# Altium project fpga_board.PrjPcb (part 2 of 2)

## Sheet FPGA2.SchDoc
size A4; SheetNumber: 8; SheetTotal: 9
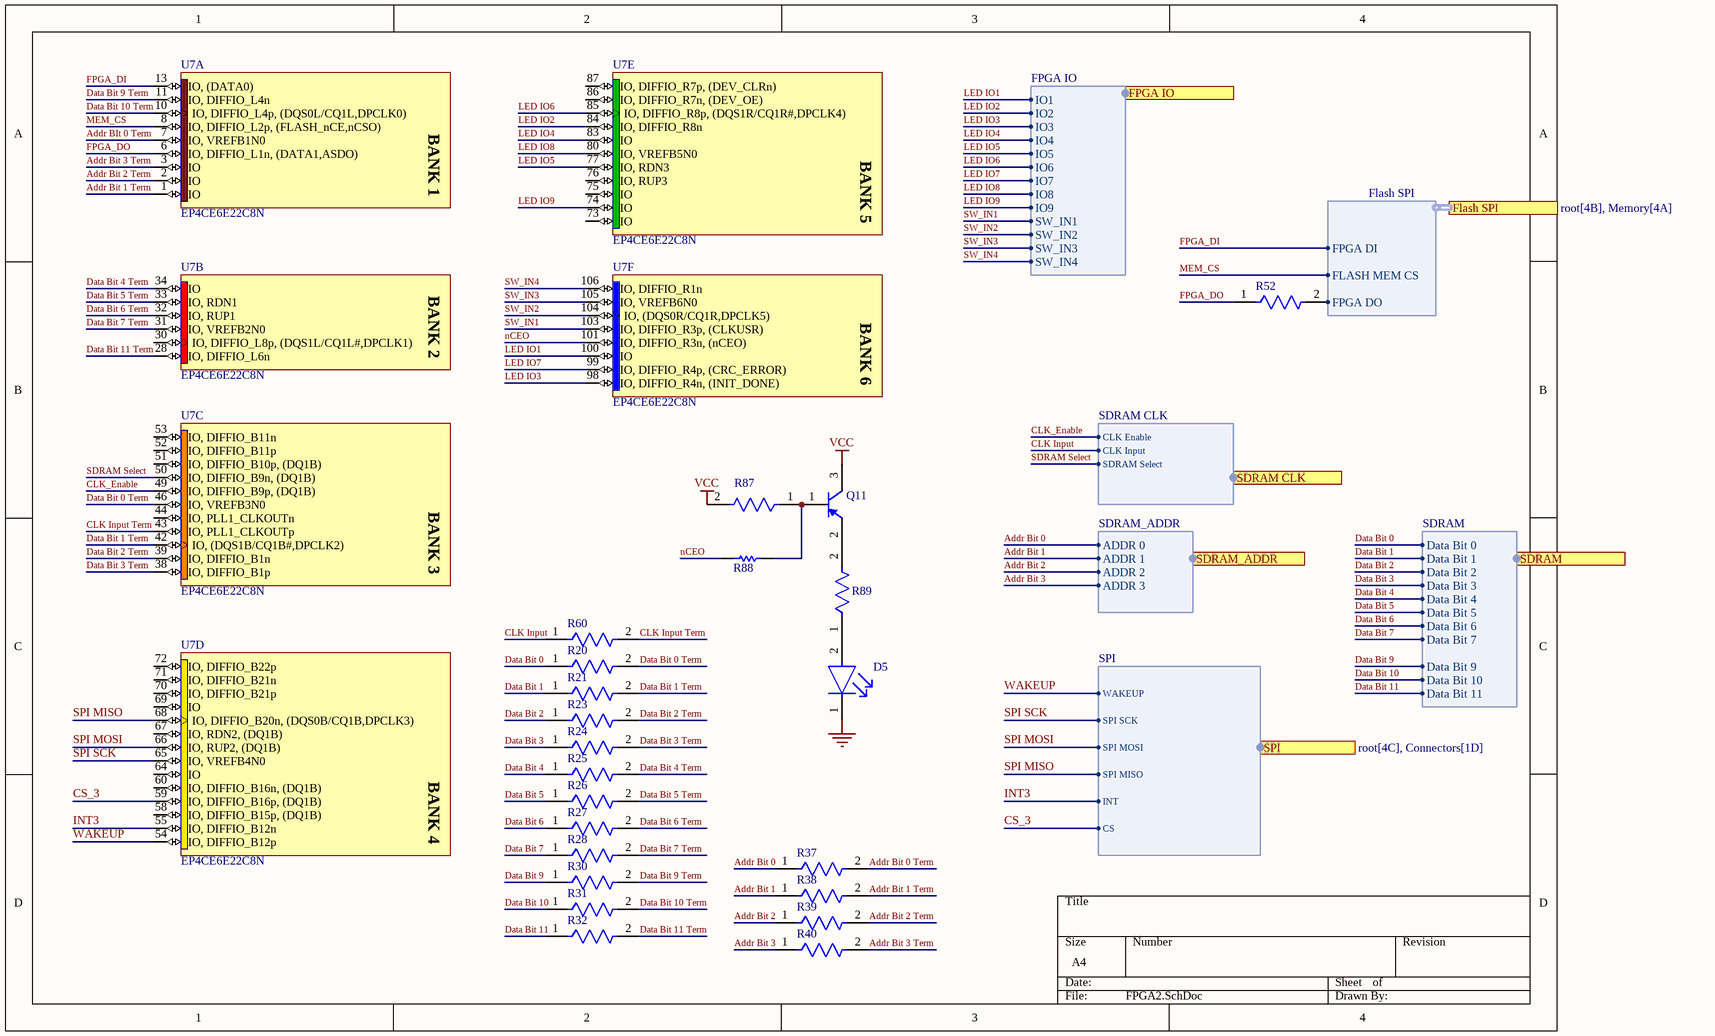
[diagram p6: FPGA2.SchDoc]

### Parts
D5  APHCM2012CGCK-F01  [FP-APHCM2012CGCK-F01-MFG]  (value not drawn)
Q11  MMBT3906LT1G  [ONSC-SOT-23-3-318-08_V]  (value not drawn)
R20  RT0402BRE0750RL  [FP-RT0402-0_35-MFG]  (value not drawn)
R21  RT0402BRE0750RL  [FP-RT0402-0_35-MFG]  (value not drawn)
R23  RT0402BRE0750RL  [FP-RT0402-0_35-MFG]  (value not drawn)
R24  RT0402BRE0750RL  [FP-RT0402-0_35-MFG]  (value not drawn)
R25  RT0402BRE0750RL  [FP-RT0402-0_35-MFG]  (value not drawn)
R26  RT0402BRE0750RL  [FP-RT0402-0_35-MFG]  (value not drawn)
R27  RT0402BRE0750RL  [FP-RT0402-0_35-MFG]  (value not drawn)
R28  RT0402BRE0750RL  [FP-RT0402-0_35-MFG]  (value not drawn)
R30  RT0402BRE0750RL  [FP-RT0402-0_35-MFG]  (value not drawn)
R31  RT0402BRE0750RL  [FP-RT0402-0_35-MFG]  (value not drawn)
R32  RT0402BRE0750RL  [FP-RT0402-0_35-MFG]  (value not drawn)
R37  RT0402BRE0750RL  [FP-RT0402-0_35-MFG]  (value not drawn)
R38  RT0402BRE0750RL  [FP-RT0402-0_35-MFG]  (value not drawn)
R39  RT0402BRE0750RL  [FP-RT0402-0_35-MFG]  (value not drawn)
R40  RT0402BRE0750RL  [FP-RT0402-0_35-MFG]  (value not drawn)
R52  RT0402BRE0750RL  [FP-RT0402-0_35-MFG]  (value not drawn)
R60  RT0402BRE0750RL  [FP-RT0402-0_35-MFG]  (value not drawn)
R87  RC0603FR-0710KL  [FP-RC0603-0_55-IPC_C]  (value not drawn)
R88  RC0402FR-07330RL  [RESC1005X40X25LL05T10]  (value not drawn)
R89  RC0603FR-0710KL  [FP-RC0603-0_55-IPC_C]  (value not drawn)
U7  EP4CE6E22C8N  [EQFP144_A-165_D2-54_M]  (parts A,B,C,D,E,F of 13)

### Ports
Flash SPI (harness Flash SPI, see root[4B], Memory[4A]), FPGA IO (harness FPGA IO, see root[4B], IOs[1A]), SDRAM (harness SDRAM, see root[4B], Memory[4B]), SDRAM CLK (harness SDRAM CLK, see root[4C], Memory[2D]), SDRAM_ADDR (harness SDRAM_ADDR, see root[4B], Memory[2C]), SPI (harness SPI, see root[4C], Connectors[1D])

### Harnesses
FPGA IO: IO1, IO2, IO3, IO4, IO5, IO6, IO7, IO8, IO9, SW_IN1, SW_IN2, SW_IN3, SW_IN4
Flash SPI: FPGA DI, FLASH MEM CS, FPGA DO
SDRAM: Data Bit 0, Data Bit 1, Data Bit 2, Data Bit 3, Data Bit 4, Data Bit 5, Data Bit 6, Data Bit 7, Data Bit 9, Data Bit 10, Data Bit 11
SDRAM_ADDR: ADDR 0, ADDR 1, ADDR 2, ADDR 3
SDRAM CLK: CLK Enable, CLK Input, SDRAM Select
SPI: WAKEUP, SPI SCK, SPI MOSI, SPI MISO, INT, CS

### Nets
GND: D5.1(C)
VCC: Q11.3(C) R87.2
Addr Bit 0: R37.1 ; port SDRAM_ADDR.ADDR 0
Addr BIt 0 Term: R37.2 U7.7(IO,_VREFB1N0)
Addr Bit 1: R38.1 ; port SDRAM_ADDR.ADDR 1
Addr Bit 1 Term: R38.2 U7.1(IO)
Addr Bit 2: R39.1 ; port SDRAM_ADDR.ADDR 2
Addr Bit 2 Term: R39.2 U7.2(IO)
Addr Bit 3: R40.1 ; port SDRAM_ADDR.ADDR 3
Addr Bit 3 Term: R40.2 U7.3(IO)
CLK Input: R60.1 ; port SDRAM CLK.CLK Input
CLK Input Term: R60.2 U7.43(IO,_PLL1_CLKOUTp)
CLK_Enable: U7.49(IO,_DIFFIO_B9p,_(DQ1B)) ; port SDRAM CLK.CLK Enable
CS_3: U7.59(IO,_DIFFIO_B16p,_(DQ1B)) ; port SPI.CS
Data Bit 0: R20.1 ; port SDRAM.Data Bit 0
Data Bit 0 Term: R20.2 U7.46(IO,_VREFB3N0)
Data Bit 1: R21.1 ; port SDRAM.Data Bit 1
Data Bit 1 Term: R21.2 U7.42(IO,_(DQS1B/CQ1B#,DPCLK2))
Data Bit 2: R23.1 ; port SDRAM.Data Bit 2
Data Bit 2 Term: R23.2 U7.39(IO,_DIFFIO_B1n)
Data Bit 3: R24.1 ; port SDRAM.Data Bit 3
Data Bit 3 Term: R24.2 U7.38(IO,_DIFFIO_B1p)
Data Bit 4: R25.1 ; port SDRAM.Data Bit 4
Data Bit 4 Term: R25.2 U7.34(IO)
Data Bit 5: R26.1 ; port SDRAM.Data Bit 5
Data Bit 5 Term: R26.2 U7.33(IO,_RDN1)
Data Bit 6: R27.1 ; port SDRAM.Data Bit 6
Data Bit 6 Term: R27.2 U7.32(IO,_RUP1)
Data Bit 7: R28.1 ; port SDRAM.Data Bit 7
Data Bit 7 Term: R28.2 U7.31(IO,_VREFB2N0)
Data Bit 9: R30.1 ; port SDRAM.Data Bit 9
Data Bit 9 Term: R30.2 U7.11(IO,_DIFFIO_L4n)
Data Bit 10: R31.1 ; port SDRAM.Data Bit 10
Data Bit 10 Term: R31.2 U7.10(IO,_DIFFIO_L4p,_(DQS0L/CQ1L,DPCLK0))
Data Bit 11: R32.1 ; port SDRAM.Data Bit 11
Data Bit 11 Term: R32.2 U7.28(IO,_DIFFIO_L6n)
FPGA DO: R52.2 ; port Flash SPI.FPGA DO
FPGA_DI: U7.13(IO,_(DATA0)) ; port Flash SPI.FPGA DI  [project net FPGA DI]
FPGA_DO: R52.1 U7.6(IO,_DIFFIO_L1n,_(DATA1,ASDO))
INT3: U7.55(IO,_DIFFIO_B12n) ; port SPI.INT
LED IO1: U7.100(IO) ; port FPGA IO.IO1  [project net IO1]
LED IO2: U7.84(IO,_DIFFIO_R8n) ; port FPGA IO.IO2  [project net IO2]
LED IO3: U7.98(IO,_DIFFIO_R4n,_(INIT_DONE)) ; port FPGA IO.IO3  [project net IO3]
LED IO4: U7.83(IO) ; port FPGA IO.IO4  [project net IO4]
LED IO5: U7.77(IO,_RDN3) ; port FPGA IO.IO5  [project net IO5]
LED IO6: U7.85(IO,_DIFFIO_R8p,_(DQS1R/CQ1R#,DPCLK4)) ; port FPGA IO.IO6  [project net IO6]
LED IO7: U7.99(IO,_DIFFIO_R4p,_(CRC_ERROR)) ; port FPGA IO.IO7  [project net IO7]
LED IO8: U7.80(IO,_VREFB5N0) ; port FPGA IO.IO8  [project net IO8]
LED IO9: U7.74(IO) ; port FPGA IO.IO9  [project net IO9]
MEM_CS: U7.8(IO,_DIFFIO_L2p,_(FLASH_nCE,nCSO)) ; port Flash SPI.FLASH MEM CS
nCEO: R88.2 U7.101(IO,_DIFFIO_R3n,_(nCEO))
SDRAM Select: U7.50(IO,_DIFFIO_B9n,_(DQ1B)) ; port SDRAM CLK.SDRAM Select
SPI MISO: U7.68(IO,_DIFFIO_B20n,_(DQS0B/CQ1B,DPCLK3)) ; port SPI.SPI MISO
SPI MOSI: U7.66(IO,_RUP2,_(DQ1B)) ; port SPI.SPI MOSI
SPI SCK: U7.65(IO,_VREFB4N0) ; port SPI.SPI SCK
SW_IN1: U7.103(IO,_DIFFIO_R3p,_(CLKUSR)) ; port FPGA IO.SW_IN1
SW_IN2: U7.104(IO,_(DQS0R/CQ1R,DPCLK5)) ; port FPGA IO.SW_IN2
SW_IN3: U7.105(IO,_VREFB6N0) ; port FPGA IO.SW_IN3
SW_IN4: U7.106(IO,_DIFFIO_R1n) ; port FPGA IO.SW_IN4
WAKEUP: U7.54(IO,_DIFFIO_B12p) ; port SPI.WAKEUP
NetD5_2: D5.2(A) R89.1
NetQ11_1: Q11.1(B) R87.1 R88.1
NetQ11_2: Q11.2(E) R89.2

Not connected (* = marked no-connect by the designer): U7 30(IO,_DIFFIO_L8p,_(DQS1L/CQ1L#,DPCLK1)) 44(IO,_PLL1_CLKOUTn) 51(IO,_DIFFIO_B10p,_(DQ1B)) 52(IO,_DIFFIO_B11p) 53(IO,_DIFFIO_B11n) 58(IO,_DIFFIO_B15p,_(DQ1B)) 60(IO,_DIFFIO_B16n,_(DQ1B)) 64(IO) 67(IO,_RDN2,_(DQ1B)) 69(IO) 70(IO,_DIFFIO_B21p) 71(IO,_DIFFIO_B21n) 72(IO,_DIFFIO_B22p) 73(IO) 75(IO) 76(IO,_RUP3) 86(IO,_DIFFIO_R7n,_(DEV_OE)) 87(IO,_DIFFIO_R7p,_(DEV_CLRn))

### Notes on the sheet
- (in symbol CMP-0038-00212-1, part A) BANK 1
- (in symbol CMP-0038-00212-1, part B) BANK 2
- (in symbol CMP-0038-00212-1, part C) BANK 3
- (in symbol CMP-0038-00212-1, part D) BANK 4
- (in symbol CMP-0038-00212-1, part E) BANK 5
- (in symbol CMP-0038-00212-1, part F) BANK 6

### Library data of the parts
D5 = CMP-44529-000062-1: LED GREEN CLEAR CHIP SMD; Dominant Wavelength: 570nm; Forward Current: 20mA; Number of LEDs: 1; Luminous Intensity: 40mcd; Forward Voltage: 2.1V; Viewing Angle: 110°; Illumination Color: Green; Lens Style: Clear; Mount: Surface Mount; Length: 2mm; Max Operating Temperature: 85°C; Series: APHCM; Width: 1.25mm; Lead Free: Lead Free; Wavelength: 570nm; Package Quantity: 1; Number of Pins: 2; Case Code (Metric): 2012; RoHS Compliant: Yes; Packaging: Tape and Reel; Lens Color: Clear; Case/Package: 0805; Case Code (Imperial): 0805; Test Current: 20mA; Color: Green; Min Operating Temperature: -40°C; Height: 0.4mm
Q11 = CMP-1048-00670-1: General Purpose Transistor, PNP Silicon, 3-Pin SOT-23, Pb-Free, Tape and Reel; Manufacturer: On Semiconductor; IC Continuous (A): -0.2; fT Min (MHz): 250; PackageDescription: 3-Pin Small Outline Transistor, Body 2.92 x 1.3 mm, Pitch 0.95 mm; PartNumber: MMBT3906LT1G; Packing: Tape and Reel; ComponentLink3Description: Package Specification; Mounting Technology: Surface Mount; ComponentLink3URL: http://www.onsemi.cn/pub_link/Collateral/318-08.PDF; ComponentLink1URL: http://www.onsemi.com/; ComponentLink2URL: http://www.onsemi.cn/pub_link/Collateral/MMBT3906LT1-D.PDF; PackageReference: SOT-23-3-318-08; Polarity: PNP; ComponentLink2Description: Datasheet; PackageVersion: Rev. AP, 11/2009; RoHS: TRUE; DatasheetVersion: Rev. 11; ComponentLink1Description: Manufacturer URL
R20 R21 R23-R28 R30-R32 R37-R40 R52 R60 = CMP-00621-71392720-1: RT0402BRE0750RL Fixed Resistor, Thin Film, 0.0625W, 50ohm, 50V, 0.1% +/-Tol, 50ppm/Cel, Surface Mount, 0402; Max Power Dissipation: 63mW; Temperature Coefficient: 50ppm/°C; Resistance: 50Ω; Features: Moisture Resistant; Max Operating Temperature: 155°C; Tolerance: 0.1%; Min Operating Temperature: -55°C; Case/Package: 0402; Packaging: Tape & Reel; RoHS: Compliant; Width: 508µm; Height: 355.6µm; NexarPartId: 71392720; Composition: Thin Film; Length: 990.6µm; Number of Terminations: 2
R87 R89 = CMP-2100-03664-2: RES 10K OHM 1% 1/10W 0603; Voltage Rating: 75V; Voltage Rating (DC): 50V; Resistance: 10kR; Power Rating: 100mW; Temperature Coefficient: 100ppm/°C; Depth: 0.8mm; Termination: SMD/SMT; Resistor Type: Thick Film; Series: RC; Construction: Rectangular; Features: Moisture Resistant; Packaging: Tape and Reel; Min Operating Temperature: -55°C; Number of Terminations: 2; Lead Pitch: 0.3mm; RoHS Compliant: Yes; Case/Package: 0603; Resistance Tolerance: 1%; Military Standard: Not; Weight: 7.1E-05oz; Number of Pins: 2; Tolerance: 1%; Length: 1.6mm; Case Code (Imperial): 0603; Lead Free: Lead Free; Width: 0.8mm; Max Power Dissipation: 100mW; Height: 0.45mm; Max Operating Temperature: 155°C; Case Code (Metric): 1608; Size Code: 0603
R88 = CMP-2002-07613-1: Manufacturer: Yageo / Phycomp; Part Number: RC0402FR-07330RL
U7 = CMP-0038-00212-1: Cyclone IV Family FPGA, 1.2V Core, 91 I/O Pins, 2 PLLs, 144-Pin QFP, Speed Grade 8, Commercial Grade, Pb-Free; Manufacturer: Altera; ComponentLink3Description: Pinout; ComponentLink4Description: Package Specification; DatasheetVersion: ver1.6, Nov-2011; ComponentLink1URL: http://www.altera.com/; ComponentLink2URL: http://www.altera.com/literature/hb/cyclone-iv/cyclone4-handbook.pdf; ComponentLink2Description: Handbook; PackageReference: EQFP144_A-165_D2-54; ComponentLink3URL: http://www.altera.com/literature/lit-dp.jsp?category=cyc%204&showspreadsheet=y; PackageVersion: ver1.0, Jan-2011; ComponentLink1Description: Manufacturer URL; ComponentLink4URL: http://www.altera.com/devicepackaging/04R00402-00.pdf; PackageDescription: 144-Pin Plastic Enhanced Quad Flat Pack (EQFP) - Wire Bond - A:1.65 - D2:5.4; Code_JEDEC: MS-026-BFB-HD

## Sheet FPGA3.SchDoc
size A4; SheetNumber: 9; SheetTotal: 9
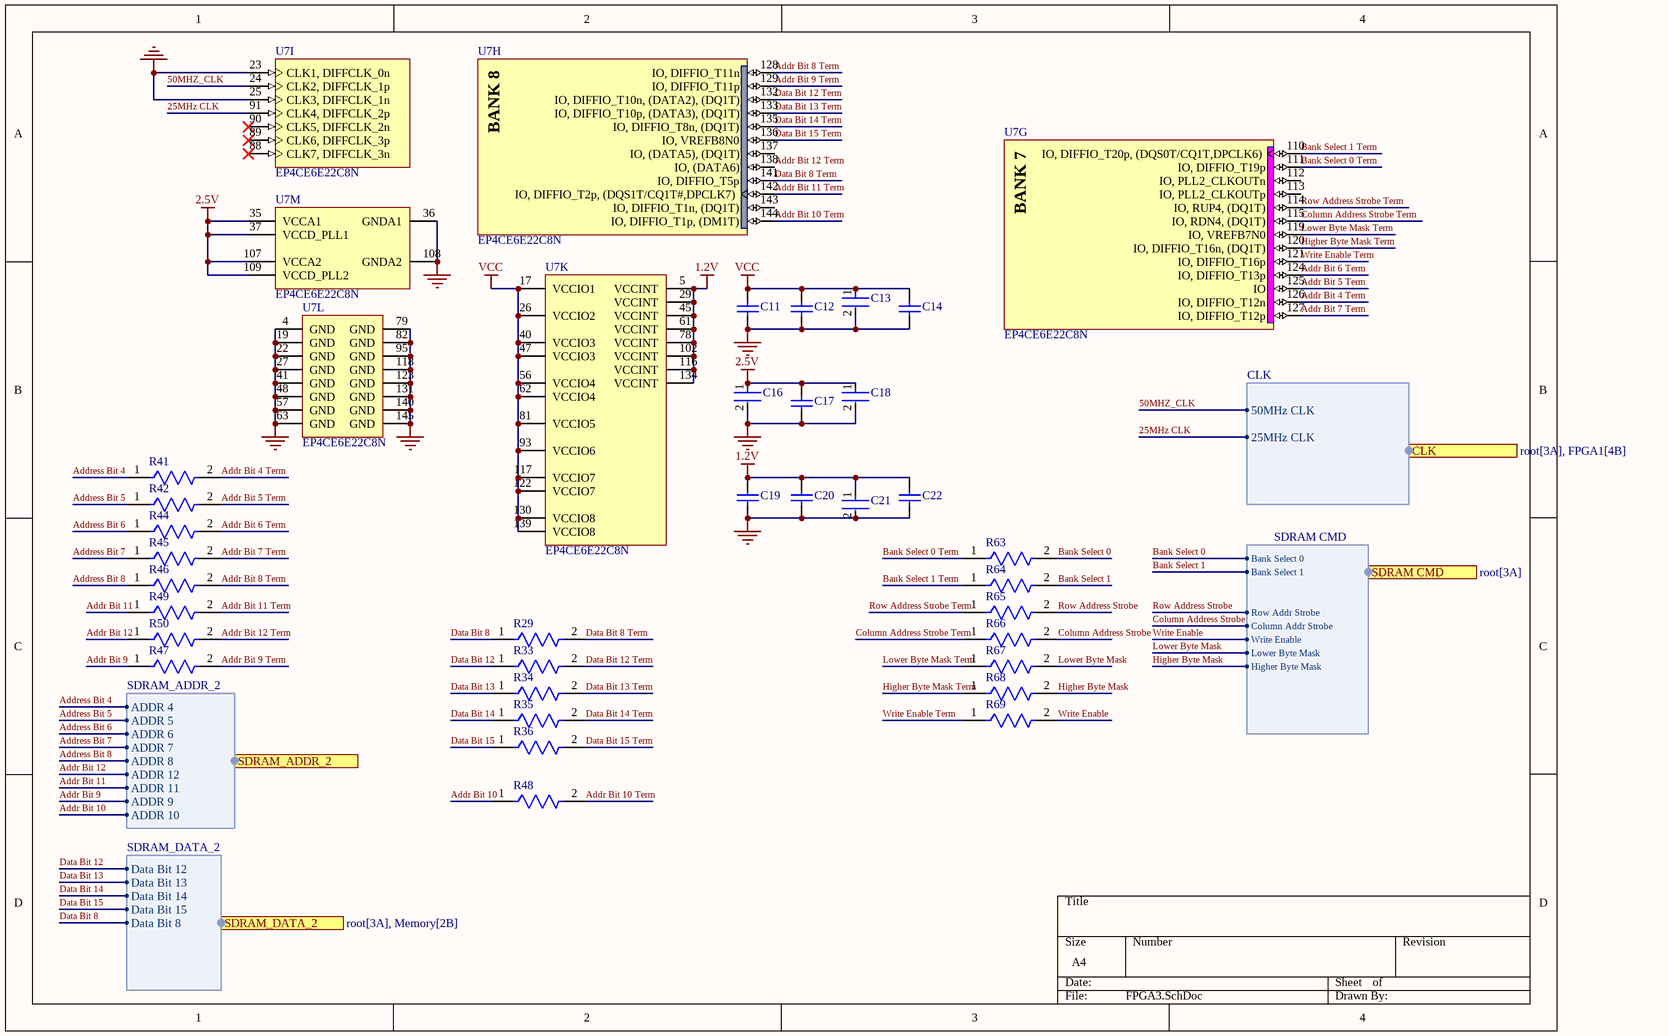
[diagram p7: FPGA3.SchDoc]

### Parts
C11  C0603C105K9PACTU  [CAPC1608X90X35LL15T15]  (value not drawn)
C12  C0603C105K9PACTU  [CAPC1608X90X35LL15T15]  (value not drawn)
C13  CC0603KRX7R9BB104  [FP-CC0603-DA-MFG]  (value not drawn)
C14  C0805S472K5RACTU  [CAPC2013X145X50ML20T25]  (value not drawn)
C16  CL10B102KB8NNNC  [FP-CL10-IPC_C]  (value not drawn)
C17  C0805S472K5RACTU  [CAPC2013X145X50ML20T25]  (value not drawn)
C18  CC0603KRX7R9BB104  [FP-CC0603-DA-MFG]  (value not drawn)
C19  C0603C105K9PACTU  [CAPC1608X90X35LL15T15]  (value not drawn)
C20  C0603C105K9PACTU  [CAPC1608X90X35LL15T15]  (value not drawn)
C21  CC0603KRX7R9BB104  [FP-CC0603-DA-MFG]  (value not drawn)
C22  C0805S472K5RACTU  [CAPC2013X145X50ML20T25]  (value not drawn)
R29  RT0402BRE0750RL  [FP-RT0402-0_35-MFG]  (value not drawn)
R33  RT0402BRE0750RL  [FP-RT0402-0_35-MFG]  (value not drawn)
R34  RT0402BRE0750RL  [FP-RT0402-0_35-MFG]  (value not drawn)
R35  RT0402BRE0750RL  [FP-RT0402-0_35-MFG]  (value not drawn)
R36  RT0402BRE0750RL  [FP-RT0402-0_35-MFG]  (value not drawn)
R41  RT0402BRE0750RL  [FP-RT0402-0_35-MFG]  (value not drawn)
R42  RT0402BRE0750RL  [FP-RT0402-0_35-MFG]  (value not drawn)
R44  RT0402BRE0750RL  [FP-RT0402-0_35-MFG]  (value not drawn)
R45  RT0402BRE0750RL  [FP-RT0402-0_35-MFG]  (value not drawn)
R46  RT0402BRE0750RL  [FP-RT0402-0_35-MFG]  (value not drawn)
R47  RT0402BRE0750RL  [FP-RT0402-0_35-MFG]  (value not drawn)
R48  RT0402BRE0750RL  [FP-RT0402-0_35-MFG]  (value not drawn)
R49  RT0402BRE0750RL  [FP-RT0402-0_35-MFG]  (value not drawn)
R50  RT0402BRE0750RL  [FP-RT0402-0_35-MFG]  (value not drawn)
R63  RT0402BRE0750RL  [FP-RT0402-0_35-MFG]  (value not drawn)
R64  RT0402BRE0750RL  [FP-RT0402-0_35-MFG]  (value not drawn)
R65  RT0402BRE0750RL  [FP-RT0402-0_35-MFG]  (value not drawn)
R66  RT0402BRE0750RL  [FP-RT0402-0_35-MFG]  (value not drawn)
R67  RT0402BRE0750RL  [FP-RT0402-0_35-MFG]  (value not drawn)
R68  RT0402BRE0750RL  [FP-RT0402-0_35-MFG]  (value not drawn)
R69  RT0402BRE0750RL  [FP-RT0402-0_35-MFG]  (value not drawn)
U7  EP4CE6E22C8N  [EQFP144_A-165_D2-54_M]  (parts G,H,I,K,L,M of 13)

### Ports
CLK (harness CLK, see root[3A], FPGA1[4B]), SDRAM CMD (harness SDRAM CMD, see root[3A]), SDRAM_ADDR_2 (harness SDRAM_ADDR_2, see root[3A], Memory[2C]), SDRAM_DATA_2 (harness SDRAM_DATA_2, see root[3A], Memory[2B])

### Harnesses
CLK: 50MHz CLK, 25MHz CLK
SDRAM CMD: Bank Select 0, Bank Select 1, Row Addr Strobe, Column Addr Strobe, Write Enable, Lower Byte Mask, Higher Byte Mask
SDRAM_ADDR_2: ADDR 4, ADDR 5, ADDR 6, ADDR 7, ADDR 8, ADDR 12, ADDR 11, ADDR 9, ADDR 10
SDRAM_DATA_2: Data Bit 12, Data Bit 13, Data Bit 14, Data Bit 15, Data Bit 8

### Nets
1.2V: C19.2 C20.2 C21.1 C22.2 U7.5(VCCINT) U7.29(VCCINT) U7.45(VCCINT) U7.61(VCCINT) U7.78(VCCINT) U7.102(VCCINT) U7.116(VCCINT) U7.134(VCCINT)
2.5V: C16.1 C17.2 C18.1 U7.35(VCCA1) U7.37(VCCD_PLL1) U7.107(VCCA2) U7.109(VCCD_PLL2)
GND: C11.1 C12.1 C13.2 C14.1 C16.2 C17.1 C18.2 C19.1 C20.1 C21.2 C22.1 U7.4(GND) U7.19(GND) U7.22(GND) U7.23(CLK1,_DIFFCLK_0n) U7.25(CLK3,_DIFFCLK_1n) U7.27(GND) U7.36(GNDA1) U7.41(GND) U7.48(GND) U7.57(GND) U7.63(GND) U7.79(GND) U7.82(GND) U7.95(GND) U7.108(GNDA2) U7.118(GND) U7.123(GND) U7.131(GND) U7.140(GND) U7.145(GND)
VCC: C11.2 C12.2 C13.1 C14.2 U7.17(VCCIO1) U7.26(VCCIO2) U7.40(VCCIO3) U7.47(VCCIO3) U7.56(VCCIO4) U7.62(VCCIO4) U7.81(VCCIO5) U7.93(VCCIO6) U7.117(VCCIO7) U7.122(VCCIO7) U7.130(VCCIO8) U7.139(VCCIO8)
25MHz CLK: U7.91(CLK4,_DIFFCLK_2p) ; port CLK.25MHz CLK
50MHZ_CLK: U7.24(CLK2,_DIFFCLK_1p) ; port CLK.50MHz CLK
Addr Bit 4 Term: R41.2 U7.126(IO,_DIFFIO_T12n)
Addr Bit 5 Term: R42.2 U7.125(IO)
Addr Bit 6 Term: R44.2 U7.124(IO,_DIFFIO_T13p)
Addr Bit 7 Term: R45.2 U7.127(IO,_DIFFIO_T12p)
Addr Bit 8 Term: R46.2 U7.128(IO,_DIFFIO_T11n)
Addr Bit 9: R47.1 ; port SDRAM_ADDR_2.ADDR 9
Addr Bit 9 Term: R47.2 U7.129(IO,_DIFFIO_T11p)
Addr Bit 10: R48.1 ; port SDRAM_ADDR_2.ADDR 10
Addr Bit 10 Term: R48.2 U7.144(IO,_DIFFIO_T1p,_(DM1T))
Addr Bit 11: R49.1 ; port SDRAM_ADDR_2.ADDR 11
Addr Bit 11 Term: R49.2 U7.142(IO,_DIFFIO_T2p,_(DQS1T/CQ1T#,DPCLK7))
Addr Bit 12: R50.1 ; port SDRAM_ADDR_2.ADDR 12
Addr Bit 12 Term: R50.2 U7.138(IO,_(DATA6))
Address Bit 4: R41.1 ; port SDRAM_ADDR_2.ADDR 4
Address Bit 5: R42.1 ; port SDRAM_ADDR_2.ADDR 5
Address Bit 6: R44.1 ; port SDRAM_ADDR_2.ADDR 6
Address Bit 7: R45.1 ; port SDRAM_ADDR_2.ADDR 7
Address Bit 8: R46.1 ; port SDRAM_ADDR_2.ADDR 8
Bank Select 0: R63.2 ; port SDRAM CMD.Bank Select 0
Bank Select 0 Term: R63.1 U7.111(IO,_DIFFIO_T19p)
Bank Select 1: R64.2 ; port SDRAM CMD.Bank Select 1
Bank Select 1 Term: R64.1 U7.110(IO,_DIFFIO_T20p,_(DQS0T/CQ1T,DPCLK6))
Column Address Strobe: R66.2 ; port SDRAM CMD.Column Addr Strobe
Column Address Strobe Term: R66.1 U7.115(IO,_RDN4,_(DQ1T))
Data Bit 8: R29.1 ; port SDRAM_DATA_2.Data Bit 8
Data Bit 8 Term: R29.2 U7.141(IO,_DIFFIO_T5p)
Data Bit 12: R33.1 ; port SDRAM_DATA_2.Data Bit 12
Data Bit 12 Term: R33.2 U7.132(IO,_DIFFIO_T10n,_(DATA2),_(DQ1T))
Data Bit 13: R34.1 ; port SDRAM_DATA_2.Data Bit 13
Data Bit 13 Term: R34.2 U7.133(IO,_DIFFIO_T10p,_(DATA3),_(DQ1T))
Data Bit 14: R35.1 ; port SDRAM_DATA_2.Data Bit 14
Data Bit 14 Term: R35.2 U7.135(IO,_DIFFIO_T8n,_(DQ1T))
Data Bit 15: R36.1 ; port SDRAM_DATA_2.Data Bit 15
Data Bit 15 Term: R36.2 U7.136(IO,_VREFB8N0)
Higher Byte Mask: R68.2 ; port SDRAM CMD.Higher Byte Mask
Higher Byte Mask Term: R68.1 U7.120(IO,_DIFFIO_T16n,_(DQ1T))
Lower Byte Mask: R67.2 ; port SDRAM CMD.Lower Byte Mask
Lower Byte Mask Term: R67.1 U7.119(IO,_VREFB7N0)
Row Address Strobe: R65.2 ; port SDRAM CMD.Row Addr Strobe
Row Address Strobe Term: R65.1 U7.114(IO,_RUP4,_(DQ1T))
Write Enable: R69.2 ; port SDRAM CMD.Write Enable
Write Enable Term: R69.1 U7.121(IO,_DIFFIO_T16p)

Not connected (* = marked no-connect by the designer): U7 88(CLK7,_DIFFCLK_3n)* 89(CLK6,_DIFFCLK_3p)* 90(CLK5,_DIFFCLK_2n)* 112(IO,_PLL2_CLKOUTn) 113(IO,_PLL2_CLKOUTp) 137(IO,_(DATA5),_(DQ1T)) 143(IO,_DIFFIO_T1n,_(DQ1T))

### Notes on the sheet
- (in symbol CMP-0038-00212-1, part G) BANK 7
- (in symbol CMP-0038-00212-1, part H) BANK 8

### Library data of the parts
C11 C12 C19 C20 = CMP-2006-02241-1: Manufacturer: Kemet; Part Number: C0603C105K9PACTU
C13 C18 C21 = CMP-2100-03601-2: CAP CER 0.1UF 50V X7R 0603; Manufacturer: YAGEO; Material: Ceramic; Capacitance: 100 nF; Temperature Coefficient: 15%; Tolerance: 0.1; Value: 100 nF; Height: 0.9mm; Voltage: 50 V; ComponentLink2Description: Datasheet; Device Class L2: Capacitors; Temperature Range High: +125°C; Category: Cap; Footprint Url: http://www.yageo.com/exep/pages/download/literatures/UPY-C_GEN_24.pdf; ComponentLink2URL: http://www.yageo.com/documents/recent/UPY-GPHC_X7R_6.3V-to-50V_18.pdf; Package: CC0603-DA; Temperature: -55°C to +125°C; Voltage Rating: 50 V; Temperature Characteristic: X7R; Device Class L1: Passive Components; Temperature Range Low: -55°C; Manufacturer Part Number: CC0603KRX7R9BB104; RoHS: TRUE; Automotive: No; Device Class L3: Ceramic Capacitors; Octopart: https://octopart.com/cc0603krx7r9bb104-yageo-42244635; Mouser Description: Multilayer Ceramic Capacitor, CC Series, 0.1 - F, - 10%, X7R, 50 V, 0603 [1608 Metric]; Lead Free: Yes; Digikey Description: CAP CER 0.1UF 50V X7R 0603
C14 C17 C22 = CMP-2007-01090-1: Manufacturer: Kemet; Part Number: C0805S472K5RACTU
C16 = CMP-2000-06091-2: Cap Ceramic 1nF 50V X7R ±10% Pad SMD 0603 +125°C T/R; Radiation Hardening: No; Length: 1.6mm; Capacitance: 1nF; Voltage Rating: 50V; Case Code (Imperial): 0603; Case Code (Metric): 1608; Max Operating Temperature: 125°C; Thickness: 0.035inch; Voltage Rating (DC): 50V; Contact Plating: Tin; Width: 0.031inch; Mount: Surface Mount; Lead Free: Lead Free; Voltage: 50V; Material: Ceramic; Package Quantity: 1; Dielectric: X7R; Case/Package: 0603; Height: 0.8mm; Min Operating Temperature: -55°C; Tolerance: 10%; Depth: 0.8mm; Packaging: Tape and Reel
R29 R33-R36 R41 R42 R44-R50 R63-R69 = CMP-00621-71392720-1: as R20 on sheet FPGA2; Features: Moisture Resistant; Max Operating Temperature: 155°C; Tolerance: 0.1%; Min Operating Temperature: -55°C; Case/Package: 0402; Packaging: Tape & Reel; RoHS: Compliant; Width: 508µm; Height: 355.6µm; NexarPartId: 71392720; Composition: Thin Film; Length: 990.6µm; Number of Terminations: 2
U7 = CMP-0038-00212-1: as U7 on sheet FPGA2; ComponentLink3Description: Pinout; ComponentLink4Description: Package Specification; DatasheetVersion: ver1.6, Nov-2011; ComponentLink1URL: http://www.altera.com/; ComponentLink2URL: http://www.altera.com/literature/hb/cyclone-iv/cyclone4-handbook.pdf; ComponentLink2Description: Handbook; PackageReference: EQFP144_A-165_D2-54; ComponentLink3URL: http://www.altera.com/literature/lit-dp.jsp?category=cyc%204&showspreadsheet=y; PackageVersion: ver1.0, Jan-2011; ComponentLink1Description: Manufacturer URL; ComponentLink4URL: http://www.altera.com/devicepackaging/04R00402-00.pdf; PackageDescription: 144-Pin Plastic Enhanced Quad Flat Pack (EQFP) - Wire Bond - A:1.65 - D2:5.4; Code_JEDEC: MS-026-BFB-HD

## Sheet Power.SchDoc
size A4; SheetNumber: 4; SheetTotal: 9
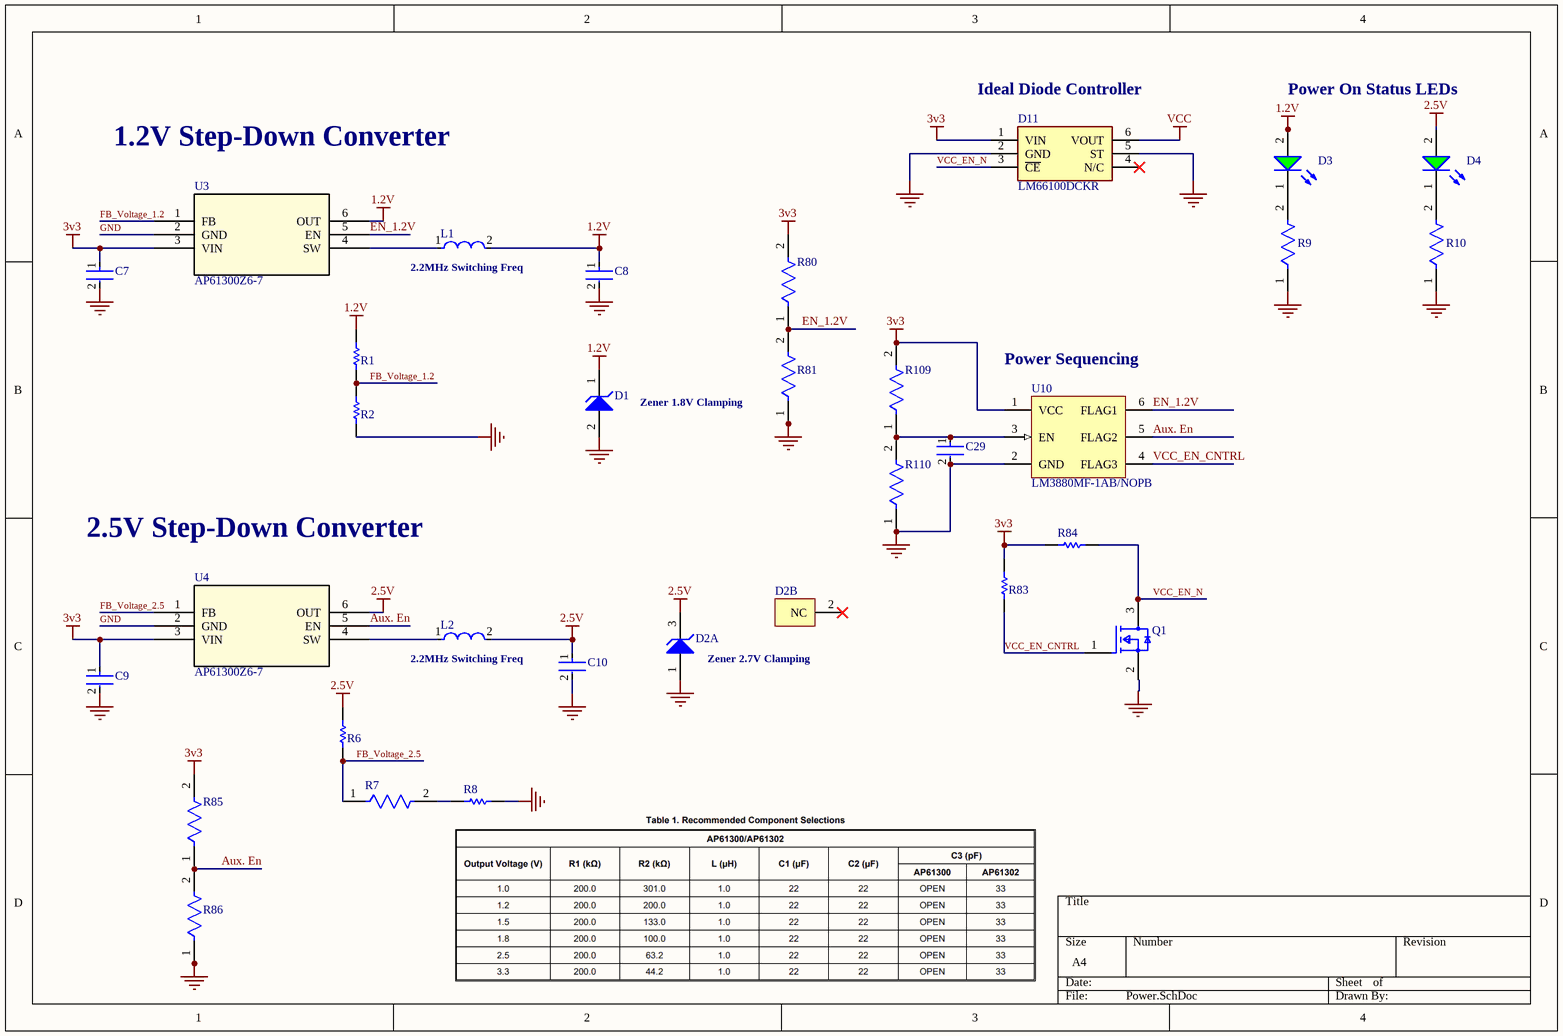
[diagram p8: Power.SchDoc]

### Parts
C7  GRT21BR61E226ME13L  [FP-GRT21B-0_2-IPC_C]  (value not drawn)
C8  GRT21BR61E226ME13L  [FP-GRT21B-0_2-IPC_C]  (value not drawn)
C9  GRT21BR61E226ME13L  [FP-GRT21B-0_2-IPC_C]  (value not drawn)
C10  GRT21BR61E226ME13L  [FP-GRT21B-0_2-IPC_C]  (value not drawn)
C29  CC0402KRX7R7BB104  [FP-CC0402-MFG]  (value not drawn)
D1  SZMMSZ4678T1G  [ONSC-SOD-123-2-425-04_V]  (value not drawn)
D2  MMBZ5223BLT1G  [ONSC-SOT-23-3-318-08_V]  (value not drawn)  (parts A,B of 2)
D3  150060VS75000  [WL-SMCW_0603_150060xx75000]  (value not drawn)
D4  150060VS75000  [WL-SMCW_0603_150060xx75000]  (value not drawn)
D11  LM66100DCKR  [SOP65P210X110-6N]
L1  MLP2012H2R2MT0S1  [FP-MLP2012M-IPC_C]  (value not drawn)
L2  MLP2012H2R2MT0S1  [FP-MLP2012M-IPC_C]  (value not drawn)
Q1  MMBF170LT1G  [FP-318-08-IPC_B]  (value not drawn)
R1  ERJ-2RKF2003X  [RESC1005X40X25NL05T05]  (value not drawn)
R2  RC0402FR-07100KL  [RESC1005X40X25NL05T10]  (value not drawn)
R6  ERJ-2RKF2003X  [RESC1005X40X25NL05T05]  (value not drawn)
R7  RT0603BRD0750KL  [FP-RT0603-0_55-MFG]  (value not drawn)
R8  RC0603FR-0713KL  [RESC1608X55X25LL10T15]  (value not drawn)
R9  RC0603FR-0710KL  [FP-RC0603-0_55-IPC_C]  (value not drawn)
R10  RC0603FR-0710KL  [FP-RC0603-0_55-IPC_C]  (value not drawn)
R80  RC0603FR-07100KL  [FP-RC0603-0_55-MFG]  (value not drawn)
R81  RT0805BRD07200KL  [FP-RT0805-MFG]  (value not drawn)
R83  RC0402FR-0710KL  [RESC1005X40X25LL05T10]  (value not drawn)
R84  RC0402FR-0710KL  [RESC1005X40X25LL05T10]  (value not drawn)
R85  RC0603FR-07100KL  [FP-RC0603-0_55-MFG]  (value not drawn)
R86  RT0805BRD07200KL  [FP-RT0805-MFG]  (value not drawn)
R109  RC0603FR-07100KL  [FP-RC0603-0_55-MFG]  (value not drawn)
R110  RC0603FR-07100KL  [FP-RC0603-0_55-MFG]  (value not drawn)
U3  AP61300Z6-7  [AP61300Z6-7_DIO]
U4  AP61300Z6-7  [AP61300Z6-7_DIO]
U10  LM3880MF-1AB/NOPB  [DBV0006A_M]

### Nets
1.2V: C8.1 D1.1(K) D3.2(A) L1.2 R1.1 U3.6(OUT)
2.5V: C10.1 D2.3(K) D4.2(A) L2.2 R6.1 U4.6(OUT)
3v3: C7.1 C9.1 D11.1(VIN) R80.2 R83.2 R84.1 R85.2 R109.2 U3.3(VIN) U4.3(VIN) U10.1(VCC)
GND: C7.2 C8.2 C9.2 C10.2 C29.2 D1.2(A) D2.1(A) D11.2(GND) D11.5(ST) R2.2 R8.2 R9.1 R10.1 R81.1 R86.1 R110.1 U3.2(GND) U4.2(GND) U10.2(GND)
VCC: D11.6(VOUT)
Aux. En: R85.1 R86.2 U4.5(EN) U10.5(FLAG2)
EN_1.2V: R80.1 R81.2 U3.5(EN) U10.6(FLAG1)
FB_Voltage_1.2: R1.2 R2.1 U3.1(FB)
FB_Voltage_2.5: R6.2 R7.1 U4.1(FB)
VCC_EN_CNTRL: Q1.1(G) R83.1 U10.4(FLAG3)
VCC_EN_N: D11.3(~{CE}) Q1.3(D) R84.2
NetC29_1: C29.1 R109.1 R110.2 U10.3(EN)
NetD3_1: D3.1(K) R9.2
NetD4_1: D4.1(K) R10.2
NetL1_1: L1.1 U3.4(SW)
NetL2_1: L2.1 U4.4(SW)
NetR7_2: R7.2 R8.1

Not connected (* = marked no-connect by the designer): D2 2(NC)*; D11 4(N/C)*; Q1 2(S)

### Notes on the sheet
- (near D11) Ideal Diode Controller
- Power On Status LEDs
- 1.2V Step-Down Converter
- (near L1) 2.2MHz Switching Freq
- (near U10) Power Sequencing
- Zener 1.8V Clamping
- 2.5V Step-Down Converter
- (near L2) 2.2MHz Switching Freq
- (near D2) Zener 2.7V Clamping

### Library data of the parts
C7-C10 = CMP-06035-011672-1: Multi-Layer Ceramic Capacitor 22uF 25V X5R ±20% 0805 Emboss T/R; Mount: Surface Mount; Case/Package: 0805; Min Operating Temperature: -55°C; Thickness: 0.057inch; Max Operating Temperature: 85°C; Case Code (Imperial): 0805; Voltage Rating: 25V; Length: 0.079inch; Ratings: AEC-Q200; Case Code (Metric): 2012; Capacitance: 22uF; Width: 0.049inch; Packaging: Tape and Reel; Tolerance: 20%
C29 = CMP-03422-000048-1: CAP CER 0.1UF 16V X7R 0402; Manufacturer: YAGEO; Material: Ceramic; Automotive Grade: NA; Capacitance: 100 nF; Temperature Coefficient: 30ppm/°C; Tolerance: 0.1; Value: 100 nF; Device Class L1: Passive Components; Temperature Range Low: -55°C; Device Class L3: Ceramic Capacitors; Temperature Characteristic: X7R; Ipc Land Pattern Name: CAPC10050X50; Temperature Range High: +125°C; Voltage Rating: 16 V; Temperature: -55°C to +125°C; RoHS: TRUE; Automotive: No; Height: 0.55mm; Device Class L2: Capacitors; Digikey Description: CAP CER 0.1UF 16V X7R 0402; Package: CC0402; Footprint Url: http://www.yageo.com/exep/pages/download/literatures/UPY-C_GEN_24.pdf; ComponentLink2Description: Datasheet; Category: Cap; Lead Free: Yes; Octopart: https://octopart.com/cc0402krx7r7bb104-yageo-42244624; ComponentLink2URL: http://www.yageo.com/documents/recent/UPY-GP_NP0_16V-to-50V_16.pdf; Manufacturer Part Number: CC0402KRX7R7BB104; Mouser Description: 0402 0.1 uF 16 V ±10 % Tolerance X7R SMT Multilayer Ceramic Capacitor
D1 = CMP-1060-00510-1: Zener Voltage Regulator, 500 mW, 2-Pin SOD-123, Pb-Free, Tape and Reel; Manufacturer: On Semiconductor; VZ Typ (V): 1.8; P Max (W): 0.5; PartNumber: SZMMSZ4678T1G; PackageDescription: 2-Pin SOD, Body 1.6 x 2.69 mm; Mounting Technology: Surface Mount; ComponentLink2URL: http://www.onsemi.com/pub_link/Collateral/MMSZ4678T1-D.PDF; ComponentLink1URL: http://www.onsemi.com/; DatasheetVersion: Rev. 9; PackageVersion: Rev. G, 10/2009; ComponentLink3Description: Package Specification; ComponentLink2Description: Datasheet; Packing: Tape and Reel; ComponentLink3URL: http://www.onsemi.com/pub_link/Collateral/425-04.PDF; RoHS: Pb-Free; PackageReference: SOD-123-2-425-04; ComponentLink1Description: Manufacturer URL
D2 = CMP-1060-01004-1: Zener Voltage Regulator, 225 mW, 3-Pin SOT-23, Pb-Free, Tape and Reel; Manufacturer: On Semiconductor; VZ Typ (V): 2.7; DatasheetVersion: Rev. 12; ComponentLink2Description: Datasheet; PackageVersion: Rev. AP, 11/2009; RoHS: Pb-Free; Packing: Tape and Reel; PackageReference: SOT-23-3-318-08; PackageDescription: 3-Pin Small Outline Transistor, Body 2.92 x 1.3 mm, Pitch 0.95 mm; ComponentLink1URL: http://www.onsemi.com/; ComponentLink3Description: Package Specification; ComponentLink2URL: http://www.onsemi.cn/pub_link/Collateral/MMBZ5221BLT1-D.PDF; PartNumber: MMBZ5223BLT1G; Mounting Technology: Surface Mount; ComponentLink1Description: Manufacturer URL; ComponentLink3URL: http://www.onsemi.cn/pub_link/Collateral/318-08.PDF
D3 D4 = CMP-1426-00006-7: WURTH ELEKTRONIK - 150060VS75000 - LED, Green, SMD, 0603, 30 mA, 2 V, 570 nm; Reverse Voltage: 5V; Power Dissipation: 72mW; Dominant Wavelength: 570nm; Peak Wavelength: 572nm; Forward Current: 100mA; Forward Voltage: 2V; Lens Style: Clear, Rectangular; Test Current: 20mA; Max Junction Temperature (Tj): 95°C; Viewing Angle: 140°; Luminous Intensity: 40mcd; Height: 700µm; Width: 800µm; Length: 1.6mm; Mount: Surface Mount; Min Operating Temperature: -40°C; Max Reverse Voltage (DC): 5V; Case Code (Imperial): 0603; Wavelength: 570nm; Color: Green; REACH SVHC: Unknown; RoHS: Compliant; Max Operating Temperature: 85°C; Packaging: Tape and Reel; Case/Package: 0603; Number of Pins: 2; Case Code (Metric): 1608
D11 = LM66100DCKR: Diode; Manufacturer_Name: Texas Instruments; Datasheet Link: http://www.ti.com/lit/gpn/LM66100; Height: 1.1mm; Manufacturer_Part_Number: LM66100DCKR; Mouser Part Number: 595-LM66100DCKR; Mouser Price/Stock: https://www.mouser.co.uk/ProductDetail/Texas-Instruments/LM66100DCKR?qs=vLWxofP3U2y2yPPrXoBBoA%3D%3D; Arrow Part Number: LM66100DCKR; Arrow Price/Stock: https://www.arrow.com/en/products/lm66100dckr/texas-instruments?region=nac
L1 L2 = CMP-08253-000154-1: Shielded Multilayer Inductor 2.2uH ±20% 1000mA 195mΩ SMD 0805; DC Resistance (DCR): 195mR; Core Material: Ferrite; Test Frequency: 2MHz; Current Rating: 1A; Packaging: Tape and Reel; Length: 0.079inch; Tolerance: 20%; Case/Package: 0805; Case Code (Imperial): 0805; Min Operating Temperature: -40°C; Inductance: 2.2uH; Case Code (Metric): 2012; Shielding: Shielded; Mount: Surface Mount; Lead Free: Lead Free; Height - Seated (Max): 0.039inch; Max Operating Temperature: 125°C; RoHS Compliant: Yes; Package Quantity: 4000; Width: 0.049inch
Q1 = CMP-1058-00793-2: MOSFET N-CH 60V 500MA SOT-23; Polarization: N; Rds On Max: 5R; Power Dissipation: 225mW; Number of Elements: 1; Element Configuration: Single; Input Capacitance: 60pF; Threshold Voltage: 3V; Polarity: N-CHANNEL; Gate to Source Voltage (Vgs): 20V; Turn-Off Delay Time: 10ns; Drain to Source Breakdown Voltage: 60V; On-State Resistance: 5R; Width: 1.3mm; Voltage Rating (DC): 60V; Package Quantity: 3000; Max Operating Temperature: 150°C; Drain to Source Resistance: 5R; Drain-source On Resistance-Max: 5R; Packaging: Tape and Reel; REACH SVHC: No SVHC; Case/Package: SOT-23-3; Number of Pins: 3; RoHS Compliant: Yes; Radiation Hardening: No; Min Operating Temperature: -55°C; Continuous Drain Current (ID): 500mA; Lead Free: Lead Free; Height: 0.94mm; Current Rating: 500mA; Turn-On Delay Time: 10ns; Series: -; Max Power Dissipation: 225mW; Length: 2.9mm; Nominal Vgs: 3V
R1 R6 = CMP-1011-00768-4: Chip Resistor, 200 KOhm, +/- 1%, 100 mW, -55 to 155 degC, 0402 (1005 Metric), RoHS, Tape and Reel; Manufacturer: Basic Passives; Case\/Package: 0402; Voltage Rating: 50 V; Power Rating: 100 mW; RoHSCompliant: true; Length: 1 mm; DatasheetVersion: 04/2015; ComponentLink2URL: http://industrial.panasonic.com/cdbs/www-data/pdf/RDA0000/AOA0000C86.pdf; Mount: Surface Mount; PackageDescription: 2-Pin Surface Mount Device, Body 1 x 0.5 mm; PartNumber: ERJ-2RKF2003X; Tolerance: 1%; Width: 0.5 mm; ComponentLink2Description: Datasheet; Packaging: Tape and Reel; REACH SVHC: No SVHC; Min Operating Temperature: -55 degC; Package Quantity: 10000; ComponentLink1Description: Manufacturer URL; Height: 0.35 mm; ComponentLink1URL: http://www.panasonic.com/; Mounting Technology: Surface Mount; Case Code (Imperial): 0402; PackageReference: 0402; Radiation Hardening: No; Pins: 2; Max Operating Temperature: 155 degC; Resistance: 200 KOhm; Case Code (Metric): 1005
R2 = CMP-2002-07343-1: Manufacturer: Yageo / Phycomp; Part Number: RC0402FR-07100KL
R7 = CMP-03412-048226-1: RES 50K OHM 0.1% 1/10W 0603
R8 = CMP-2000-06927-1: Chip Resistor, 13 KOhm, +/- 1%, 0.1 W, -55 to 155 degC, 0603 (1608 Metric), RoHS, Tape and Reel; Manufacturer: Yageo; Resistance: 13kOhms; Temperature Coefficient: 100PPM/C; Voltage Rating: 50V; Power Rating: 100mW; Packaging: Reel; Case Code - mm: 1608; Manufacturer URL: http://www.yageo.com/; Tolerance: 1%; Product: ThickFilmResistorsGeneralPurpose; Datasheet URL: http://www.yageo.com/documents/recent/PYu-RC_Group_51_RoHS_L_7.pdf; Package Reference: 0603; Operating Temperature Range: -55Cto+155C; Package Description: 2-Pin Surface Mount Device, Body 1.6 x 0.8 mm; Termination Style: SMD/SMT; Series: RC; Case Code - in: 0603; Datasheet Version: Rev. 7, 05/2017; Mounting Technology: SurfaceMount
R9 R10 = CMP-2100-03664-2: as R87 on sheet FPGA2; Depth: 0.8mm; Termination: SMD/SMT; Resistor Type: Thick Film; Series: RC; Construction: Rectangular; Features: Moisture Resistant; Packaging: Tape and Reel; Min Operating Temperature: -55°C; Number of Terminations: 2; Lead Pitch: 0.3mm; RoHS Compliant: Yes; Case/Package: 0603; Resistance Tolerance: 1%; Military Standard: Not; Weight: 7.1E-05oz; Number of Pins: 2; Tolerance: 1%; Length: 1.6mm; Case Code (Imperial): 0603; Lead Free: Lead Free; Width: 0.8mm; Max Power Dissipation: 100mW; Height: 0.45mm; Max Operating Temperature: 155°C; Case Code (Metric): 1608; Size Code: 0603
R80 R85 R109 R110 = CMP-2100-03662-2: RES SMD 100K OHM 1% 1/10W 0603; Voltage Rating (DC): 50V; Resistance: 100kR; Max Power Dissipation: 100mW; Temperature Coefficient: 100ppm/°C; Working Voltage: 75V; Length: 1.6mm; Lead Free: Lead Free; Number of Terminations: 2; Packaging: Tape and Reel; Voltage Rating: 50V; Termination: SMD/SMT; Width: 0.8mm; Resistor Type: Thick Film; Resistance Tolerance: 1%; Features: Moisture Resistant; Height: 0.45mm; Construction: Rectangular; Case/Package: 0603; Military Standard: Not; Case Code (Imperial): 0603; Series: RC; Technology: THICK FILM; Depth: 0.8mm; RoHS Compliant: Yes; REACH SVHC: No SVHC; Min Operating Temperature: -55°C; Case Code (Metric): 1608; Max Operating Temperature: 155°C; Power Rating: 100mW; Number of Pins: 2; Tolerance: 1%
R81 R86 = CMP-2001-01722-2: RES SMD 200K OHM 0.1% 1/8W 0805; Manufacturer: Yageo; Voltage Rating: 150V; Resistance: 200KΩ; Power Rating: 0.125W; Value: 200KΩ; Tolerance: 0.0025; Temperature Coefficient: 25 ppm/°C; Automotive: No; Manufacturer Part Number: RT0805BRD07200KL; Package: RT0805; RoHS: TRUE; Ipc Land Pattern Name: RESC200125X50; Series: RT; Height: 0.6mm; Device Class L1: Passive Components; Footprint Url: http://www.yageo.com/exep/pages/download/literatures/PYu-R_Mount_10.pdf; Mouser Description: High Precision-High Stability Chip Resistor Thin Film 0805 200kOhm 0.1% Paper T/R; Composition: Thin Film; Temperature: -55°C to +155°C; Device Class L3: Chip SMD Resistors; Temperature Range Low: -55°C; Octopart: https://octopart.com/rt0805brd07200kl-yageo-1477199; Device Class L2: Resistors; Temperature Range High: +155°C; ComponentLink2Description: Datasheet; Category: Res; Lead Free: Yes; ComponentLink2URL: http://www.yageo.com/documents/recent/PYu-RT_1-to-0.01_RoHS_L_9.pdf; Digikey Description: RES SMD 200K OHM 0.1% 1/8W 0805
R83 R84 = CMP-2002-07353-1: Manufacturer: Yageo / Phycomp; Part Number: RC0402FR-0710KL
U3 U4 = AP61300Z6-7: No Description Available; Manufacturer_Name: Diodes Inc; Copyright: Copyright (C) 2025 Ultra Librarian. All rights reserved.; Manufacturer_Part_Number: AP61300Z6-7; RefDes: RefDes; Type: Type
U10 = CMP-0063-01011-4: Power Sequencer, 6-pin SOT-23, Pb-Free, 1000 Reel; Manufacturer: Texas Instruments; High-Reliability: Y; CompType: MiscPower; PowerWise: N; PackageTopMarking: F21A*XTT; Code_JEDEC: MO-178-AB; PartNumber: LM3880MF-1AB/NOPB; RoHS: Y; PackageReference: DBV0006A; ComponentLink1Description: Datasheet URL; Code_IPC: SOT26A-6; PinCount: 6; PackageDescription: Molded SOT-23, .115 x .063 x .040in Body, 6 Lead, .0375in in Pitch; ComponentLink1URL: http://www.ti.com/general/docs/lit/getliterature.tsp?genericPartNumber=LM3880&fileType=pdf

## Nets that join several sheets
1.2V: FPGA3 (12 pins), Power (6 pins)
2.5V: FPGA1 (U7.94), FPGA3 (7 pins), Power (6 pins)
3v3: Connectors (5 pins), USB (C25.2 U8.5), Power (11 pins)
GND: FPGA1 (5 pins), IOs (34 pins), Memory (8 pins), Connectors (27 pins), USB (19 pins), FPGA2 (D5.1), FPGA3 (31 pins), Power (19 pins)
VCC: FPGA1 (7 pins), IOs (13 pins), Memory (9 pins), Connectors (P1.4 R101.1 R102.1), USB (R61.1), FPGA2 (Q11.3 R87.2), FPGA3 (16 pins), Power (D11.6)
25MHz CLK: FPGA1 (R73.2), FPGA3 (U7.91)
50MHZ_CLK: FPGA1 (R72.2), FPGA3 (U7.24)
Addr Bit 0: Memory (B1.23), FPGA2 (R37.1)
Addr Bit 1: Memory (B1.24), FPGA2 (R38.1)
Addr Bit 2: Memory (B1.25), FPGA2 (R39.1)
Addr Bit 3: Memory (B1.26), FPGA2 (R40.1)
Addr Bit 9: Memory (B1.34), FPGA3 (R47.1)
Addr Bit 10: Memory (B1.22), FPGA3 (R48.1)
Addr Bit 11: Memory (B1.35), FPGA3 (R49.1)
Addr Bit 12: Memory (B1.36), FPGA3 (R50.1)
Address Bit 4: Memory (B1.29), FPGA3 (R41.1)
Address Bit 5: Memory (B1.30), FPGA3 (R42.1)
Address Bit 6: Memory (B1.31), FPGA3 (R44.1)
Address Bit 7: Memory (B1.32), FPGA3 (R45.1)
Address Bit 8: Memory (B1.33), FPGA3 (R46.1)
Bank Select 0: Memory (B1.20), FPGA3 (R63.2)
Bank Select 1: Memory (B1.21), FPGA3 (R64.2)
CLK Input: Memory (B1.38), FPGA2 (R60.1)
CLK_Enable: Memory (B1.37), FPGA2 (U7.49)
Column Address Strobe: Memory (B1.17), FPGA3 (R66.2)
CS_3: Connectors (J2.A21 J2.B21), FPGA2 (U7.59)
Data Bit 0: Memory (B1.2), FPGA2 (R20.1)
Data Bit 1: Memory (B1.4), FPGA2 (R21.1)
Data Bit 2: Memory (B1.5), FPGA2 (R23.1)
Data Bit 3: Memory (B1.7), FPGA2 (R24.1)
Data Bit 4: Memory (B1.8), FPGA2 (R25.1)
Data Bit 5: Memory (B1.10), FPGA2 (R26.1)
Data Bit 6: Memory (B1.11), FPGA2 (R27.1)
Data Bit 7: Memory (B1.13), FPGA2 (R28.1)
Data Bit 8: Memory (B1.42), FPGA3 (R29.1)
Data Bit 9: Memory (B1.44), FPGA2 (R30.1)
Data Bit 10: Memory (B1.45), FPGA2 (R31.1)
Data Bit 11: Memory (B1.47), FPGA2 (R32.1)
Data Bit 12: Memory (B1.48), FPGA3 (R33.1)
Data Bit 13: Memory (B1.50), FPGA3 (R34.1)
Data Bit 14: Memory (B1.51), FPGA3 (R35.1)
Data Bit 15: Memory (B1.53), FPGA3 (R36.1)
DCLK: FPGA1 (U7.12), Memory (IC1.6)
FPGA DI: Memory (R100.1), FPGA2 (U7.13)
FPGA DO: Memory (IC1.5), FPGA2 (R52.2)
Higher Byte Mask: Memory (B1.39), FPGA3 (R68.2)
INT3: Connectors (J2.A19 J2.B19), FPGA2 (U7.55)
IO1: IOs (R90.2), FPGA2 (U7.100)
IO2: IOs (R91.2), FPGA2 (U7.84)
IO3: IOs (R92.2), FPGA2 (U7.98)
IO4: IOs (R93.2), FPGA2 (U7.83)
IO5: IOs (R94.2), FPGA2 (U7.77)
IO6: IOs (R95.2), FPGA2 (U7.85)
IO7: IOs (R96.2), FPGA2 (U7.99)
IO8: IOs (R97.2), FPGA2 (U7.80)
IO9: IOs (R98.2), FPGA2 (U7.74)
JTAG TCK: FPGA1 (U7.16), Connectors (P1.1 R103.2)
JTAG TDI: FPGA1 (U7.15), Connectors (R102.2 R111.1 R112.1)
JTAG TDO: FPGA1 (U7.20), Connectors (R113.1 R114.1)
JTAG TMS: FPGA1 (U7.18), Connectors (P1.5 R101.2)
Lower Byte Mask: Memory (B1.15), FPGA3 (R67.2)
MEM_CS: Memory (IC1.1), FPGA2 (U7.8)
Row Address Strobe: Memory (B1.18), FPGA3 (R65.2)
SDRAM Select: Memory (B1.19), FPGA2 (U7.50)
SPI MISO: Connectors (J2.A9 J2.B9), FPGA2 (U7.68)
SPI MOSI: Connectors (J2.A7 J2.B7), FPGA2 (U7.66)
SPI SCK: Connectors (J2.A5 J2.B5), FPGA2 (U7.65)
SW_IN1: IOs (C30.1 D7.1 R53.2 R105.2), FPGA2 (U7.103)
SW_IN2: IOs (C31.1 D8.1 R54.2 R106.2), FPGA2 (U7.104)
SW_IN3: IOs (C32.1 D9.1 R55.2 R107.2), FPGA2 (U7.105)
SW_IN4: IOs (C33.1 D10.1 R56.2 R108.2), FPGA2 (U7.106)
WAKEUP: Connectors (J2.A3 J2.B3), FPGA2 (U7.54)
Write Enable: Memory (B1.16), FPGA3 (R69.2)

## Assembly variants
Variant A: not fitted C11 C14 C22 C30 C31 C32 C33 D7 D8 D9 D10 IC1 R53 R54 R55 R56 R105 R106 R107 R108 R112 R114 SW1 SW2 SW3 SW4